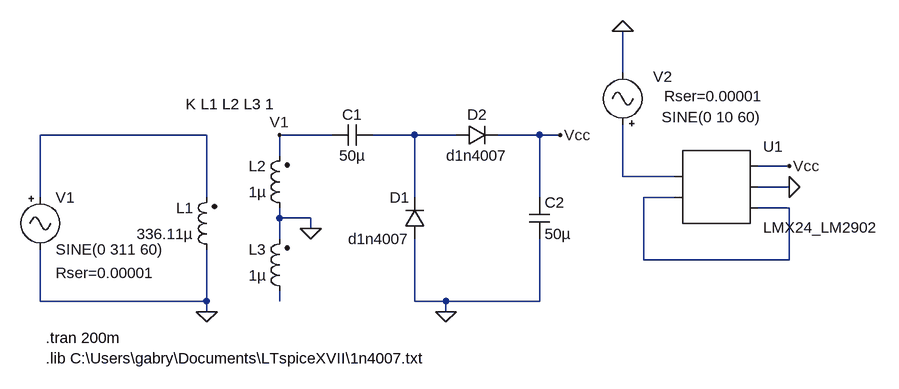
[diagram p0: schematic Draft2.asc]
* Draft2.asc
V1 N001 0 SINE(0 311 60) Rser=0.00001
L1 0 N001 336.11µ
L2 0 V1 1µ
L3 N005 0 1µ
C1 N002 V1 50µ
D1 0 N002 d1n4007
D2 N002 Vcc d1n4007
C2 Vcc 0 50µ
* U1: LMX24_LM2902 (symbol AutoGenerated\LMX24_LM2902 not available, pins judged from their places): pin1=N003 pin2=N004 pin3=Vcc pin4=0 pin5=N004
V2 N003 0 SINE(0 10 60) Rser=0.00001
.model D D
.lib standard.dio
K L1 L2 L3 1
.lib C:\Users\gabry\Documents\LTspiceXVII\1n4007.txt
.tran 200m
.backanno
.end

* Results of the author's LTspice run, read from the files saved beside the schematic
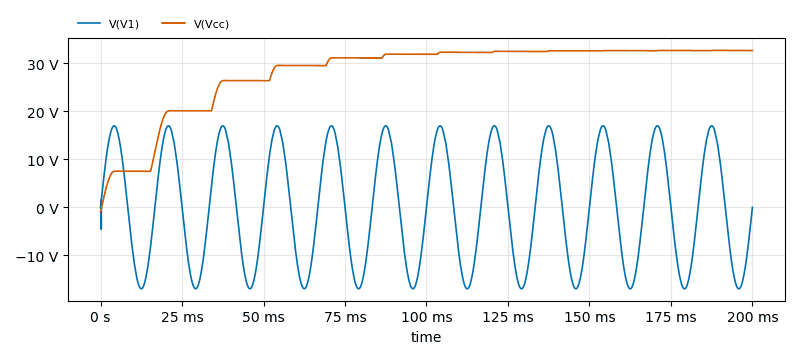
[diagram p1: Transient Analysis of Draft2.asc, plotted from the saved traces]
* Transient Analysis, 1 run:
*   V(V1): min -16.96 V, max 16.96 V, average -12.66 mV, rms 11.99 V, last 0 V
*   V(Vcc): min -892.6 mV, max 32.66 V, average 28.18 V, rms 29.17 V, last 32.62 V